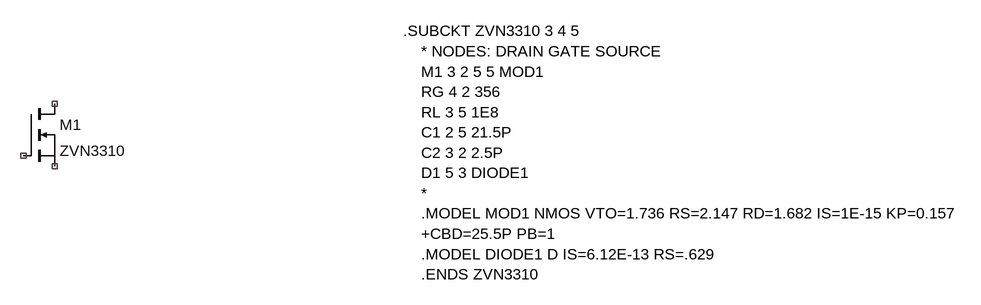
[diagram p0: schematic ZVN3310A.asc]
ZVN3310A.asc, the LTspice schematic file:
Version 4
SHEET 1 1648 680
SYMBOL nmos 160 112 R0
SYMATTR InstName M1
SYMATTR Value ZVN3310
SYMATTR Prefix X
TEXT 744 0 Left 2 !.SUBCKT ZVN3310 3 4 5\n    * NODES: DRAIN GATE SOURCE\n    M1 3 2 5 5 MOD1   \n    RG 4 2 356\n    RL 3 5 1E8\n    C1 2 5 21.5P\n    C2 3 2 2.5P \n    D1 5 3 DIODE1\n    *\n    .MODEL MOD1 NMOS VTO=1.736 RS=2.147 RD=1.682 IS=1E-15 KP=0.157\n    +CBD=25.5P PB=1\n    .MODEL DIODE1 D IS=6.12E-13 RS=.629\n    .ENDS ZVN3310

The netlist it stands for:
* ZVN3310A.asc
XM1 NC_01 NC_02 NC_03 ZVN3310  ; pins D G S
.SUBCKT ZVN3310 3 4 5
    * NODES: DRAIN GATE SOURCE
    M1 3 2 5 5 MOD1
    RG 4 2 356
    RL 3 5 1E8
    C1 2 5 21.5P
    C2 3 2 2.5P
    D1 5 3 DIODE1
    *
    .MODEL MOD1 NMOS VTO=1.736 RS=2.147 RD=1.682 IS=1E-15 KP=0.157
    +CBD=25.5P PB=1
    .MODEL DIODE1 D IS=6.12E-13 RS=.629
    .ENDS ZVN3310
.backanno
.end